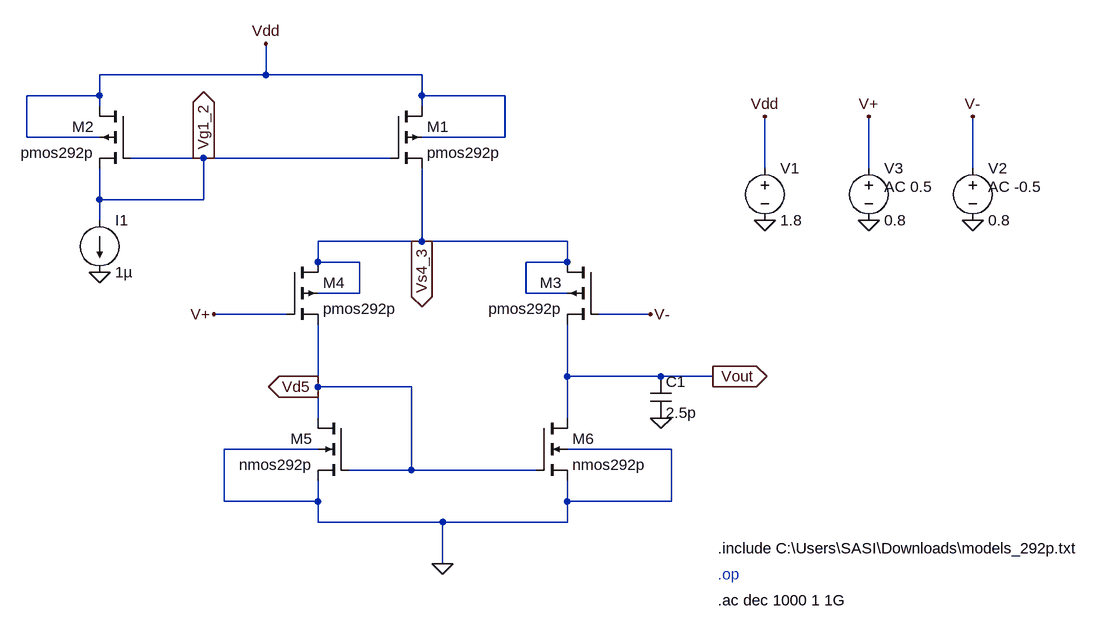
[diagram p0: schematic 5T_OTA_PMOS.asc]
5T_OTA_PMOS.asc, the LTspice schematic file:
Version 4.1
SHEET 1 1736 680
WIRE 416 -336 416 -384
WIRE 416 -336 160 -336
WIRE 656 -336 416 -336
WIRE 160 -304 160 -336
WIRE 160 -304 48 -304
WIRE 656 -304 656 -336
WIRE 784 -304 656 -304
WIRE 160 -288 160 -304
WIRE 656 -288 656 -304
WIRE 48 -240 48 -304
WIRE 160 -240 48 -240
WIRE 784 -240 784 -304
WIRE 784 -240 656 -240
WIRE 320 -208 208 -208
WIRE 608 -208 320 -208
WIRE 1184 -192 1184 -272
WIRE 1344 -192 1344 -272
WIRE 1504 -192 1504 -272
WIRE 160 -144 160 -192
WIRE 320 -144 320 -208
WIRE 320 -144 160 -144
WIRE 160 -112 160 -144
WIRE 656 -80 656 -192
WIRE 656 -80 496 -80
WIRE 880 -80 656 -80
WIRE 496 -48 496 -80
WIRE 560 -48 496 -48
WIRE 880 -48 880 -80
WIRE 880 -48 816 -48
WIRE 560 0 560 -48
WIRE 560 0 496 0
WIRE 816 0 816 -48
WIRE 880 0 816 0
WIRE 448 32 336 32
WIRE 1008 32 928 32
WIRE 880 128 880 48
WIRE 1024 128 880 128
WIRE 1104 128 1024 128
WIRE 496 144 496 48
WIRE 640 144 496 144
WIRE 496 192 496 144
WIRE 880 192 880 128
WIRE 496 240 352 240
WIRE 1040 240 880 240
WIRE 640 272 640 144
WIRE 640 272 544 272
WIRE 832 272 640 272
WIRE 352 320 352 240
WIRE 496 320 496 288
WIRE 496 320 352 320
WIRE 880 320 880 288
WIRE 1040 320 1040 240
WIRE 1040 320 880 320
WIRE 496 352 496 320
WIRE 688 352 496 352
WIRE 880 352 880 320
WIRE 880 352 688 352
WIRE 688 416 688 352
FLAG 1184 -112 0
FLAG 1344 -112 0
FLAG 1504 -112 0
FLAG 1184 -272 Vdd
FLAG 1344 -272 V+
FLAG 1504 -272 V-
FLAG 688 416 0
FLAG 160 -32 0
FLAG 336 32 V+
FLAG 1008 32 V-
FLAG 1104 128 Vout
IOPIN 1104 128 Out
FLAG 416 -384 Vdd
FLAG 496 144 Vd5
IOPIN 496 144 Out
FLAG 656 -80 Vs4_3
IOPIN 656 -80 Out
FLAG 320 -208 Vg1_2
IOPIN 320 -208 Out
FLAG 1024 192 0
SYMBOL voltage 1184 -208 R0
WINDOW 123 0 0 Left 0
WINDOW 39 0 0 Left 0
SYMATTR InstName V1
SYMATTR Value 1.8
SYMBOL pmos4 608 -288 R0
SYMATTR InstName M1
SYMATTR Value pmos292p
SYMATTR Value2 l=1u w=50u
SYMBOL pmos4 208 -288 M0
SYMATTR InstName M2
SYMATTR Value pmos292p
SYMATTR Value2 l=1u w=50u
SYMBOL pmos4 928 -48 M0
SYMATTR InstName M3
SYMATTR Value pmos292p
SYMATTR Value2 l=0.9u w=50u
SYMBOL pmos4 448 -48 R0
SYMATTR InstName M4
SYMATTR Value pmos292p
SYMATTR Value2 l=0.9u w=50u
SYMBOL nmos4 544 192 M0
SYMATTR InstName M5
SYMATTR Value nmos292p
SYMATTR Value2 l=0.54u w=25u
SYMBOL nmos4 832 192 R0
SYMATTR InstName M6
SYMATTR Value nmos292p
SYMATTR Value2 l=0.54u w=25u
SYMBOL current 160 -112 R0
WINDOW 123 0 0 Left 0
WINDOW 39 0 0 Left 0
SYMATTR InstName I1
SYMATTR Value 1µ
SYMBOL voltage 1504 -208 R0
WINDOW 123 24 44 Left 2
WINDOW 39 0 0 Left 0
SYMATTR Value2 AC -0.5
SYMATTR InstName V2
SYMATTR Value 0.8
SYMBOL voltage 1344 -208 R0
WINDOW 123 24 44 Left 2
WINDOW 39 0 0 Left 0
SYMATTR Value2 AC 0.5
SYMATTR InstName V3
SYMATTR Value 0.8
SYMBOL cap 1008 128 R0
SYMATTR InstName C1
SYMATTR Value 2.5p
TEXT 1112 392 Left 2 !.include C:\\Users\\SASI\\Downloads\\models_292p.txt
TEXT 1112 432 Left 2 ;.op
TEXT 1112 472 Left 2 !.ac dec 1000 1 1G

The netlist it stands for:
* 5T_OTA_PMOS.asc
V1 Vdd 0 1.8
M1 Vdd Vg1_2 Vs4_3 Vdd pmos292p l=1u w=50u
M2 Vdd Vg1_2 Vg1_2 Vdd pmos292p l=1u w=50u
M3 Vs4_3 V- Vout Vs4_3 pmos292p l=0.9u w=50u
M4 Vs4_3 V+ Vd5 Vs4_3 pmos292p l=0.9u w=50u
M5 Vd5 Vd5 0 0 nmos292p l=0.54u w=25u
M6 Vout Vd5 0 0 nmos292p l=0.54u w=25u
I1 Vg1_2 0 1µ
V2 V- 0 0.8 AC -0.5
V3 V+ 0 0.8 AC 0.5
C1 Vout 0 2.5p
.model NMOS NMOS
.model PMOS PMOS
.lib standard.mos
.include C:\Users\SASI\Downloads\models_292p.txt
* .op
.ac dec 1000 1 1G
.backanno
.end